# Altium project USB Charger Project.PrjPcb
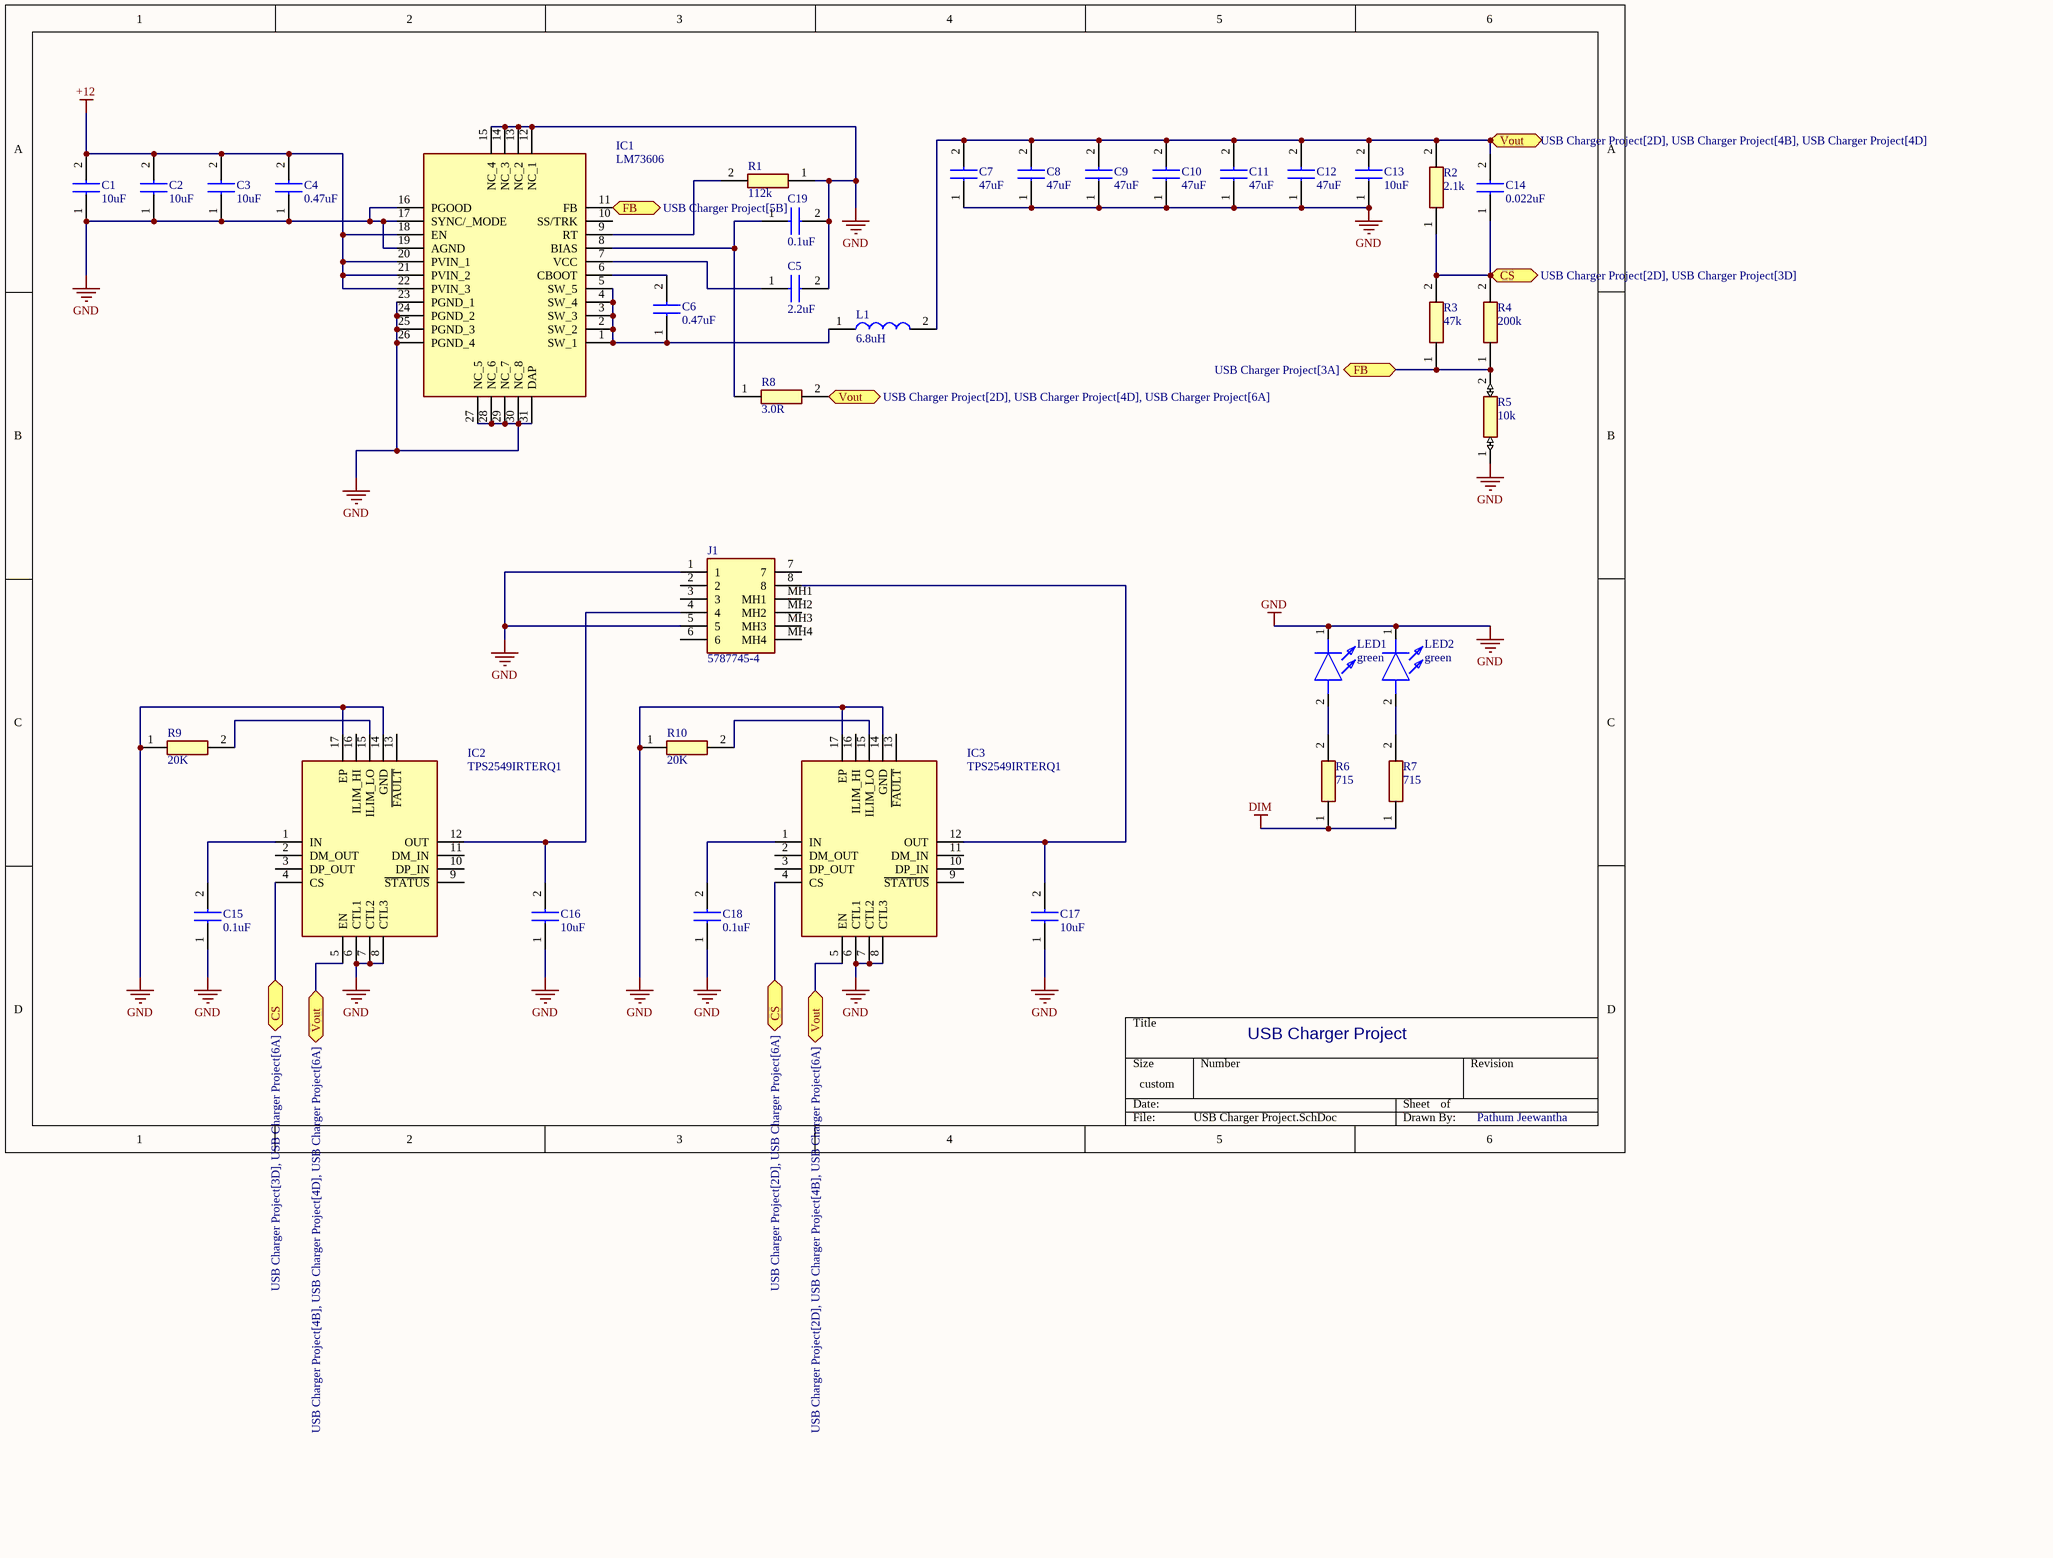
[diagram p0: USB Charger Project.SchDoc]
1 sheet, 36 parts. Net scope: flat (ports and power ports of the same name join across sheets).
Board file: USB Charger Project.PcbDoc

## Sheet USB Charger Project.SchDoc: USB Chager Schematic
size 304 x 215 mm; Author: P J Dissanayake; DrawnBy: P J Dissanayake; SheetNumber: 1; SheetTotal: 1

### Parts
C1  10uF  [CAPPM7343X120N]
C2  10uF  [CAPPM7343X120N]
C3  10uF  [CAPPM7343X120N]
C4  0.47uF  [CAPC6050X550N]
C5  2.2uF  [CAPC1608X80N]
C6  0.47uF  [CAPC6050X550N]
C7  47uF  [CAPC3225X270N]
C8  47uF  [CAPC3225X270N]
C9  47uF  [CAPC3225X270N]
C10  47uF  [CAPC3225X270N]
C11  47uF  [CAPC3225X270N]
C12  47uF  [CAPC3225X270N]
C13  10uF  [CAPPM7343X120N]
C14  0.022uF  [CAPC2012X88N]
C15  0.1uF  [C0805]
C16  10uF  [CAPPM7343X120N]
C17  10uF  [CAPPM7343X120N]
C18  0.1uF  [C0805]
C19  0.1uF  [C0805]
IC1  LM73606  [QFN50P400X600X80-31N-D]
IC2  TPS2549IRTERQ1  [QFN50P300X300X80-17N-D]
IC3  TPS2549IRTERQ1  [QFN50P300X300X80-17N-D]
J1  5787745-4  [57877454]
L1  6.8uH  [SDR08056R8ML]
LED1  green  [LEDM2012X80N]
LED2  green  [LEDM2012X80N]
R1  112k  [RESC0603X28N]
R2  2.1k  [RESC1005X35N]
R3  47k  [RESC2012X65N]
R4  200k  [RESC1608X55N]
R5  10k  [RESC6432X120N]
R6  715  [RESC1608X55N]
R7  715  [RESC1608X55N]
R8  3.0R  [ERJ2RKD1004X]
R9  20K  [RESC2013X65N]
R10  20K  [RESC2013X65N]

### Ports
CS (bidir, see USB Charger Project[2D], USB Charger Project[3D]), CS (bidir, see USB Charger Project[2D], USB Charger Project[6A]), CS (bidir, see USB Charger Project[3D], USB Charger Project[6A]), FB (bidir, see USB Charger Project[3A]), FB (bidir, see USB Charger Project[5B]), Vout (bidir, see USB Charger Project[2D], USB Charger Project[4B], USB Charger Project[4D]), Vout (bidir, see USB Charger Project[2D], USB Charger Project[4B], USB Charger Project[6A]), Vout (bidir, see USB Charger Project[2D], USB Charger Project[4D], USB Charger Project[6A]), Vout (bidir, see USB Charger Project[4B], USB Charger Project[4D], USB Charger Project[6A])

### Nets
+12: C1.2(-) C2.2(-) C3.2(-) C4.2 IC1.18(EN) IC1.20(PVIN_1) IC1.21(PVIN_2) IC1.22(PVIN_3)
DIM: R6.1 R7.1
GND: C1.1(+) C2.1(+) C3.1(+) C4.1 C5.2 C7.1 C8.1 C9.1 C10.1 C11.1 C12.1 C13.1(+) C15.1 C16.1(+) C17.1(+) C18.1 C19.2 IC1.12(NC_1) IC1.13(NC_2) IC1.14(NC_3) IC1.15(NC_4) IC1.16(PGOOD) IC1.17(SYNC/_MODE) IC1.19(AGND) IC1.23(PGND_1) IC1.24(PGND_2) IC1.25(PGND_3) IC1.26(PGND_4) IC1.27(NC_5) IC1.28(NC_6) IC1.29(NC_7) IC1.30(NC_8) IC1.31(DAP) IC2.6(CTL1) IC2.7(CTL2) IC2.8(CTL3) IC2.14(GND) IC2.17(EP) IC3.6(CTL1) IC3.7(CTL2) IC3.8(CTL3) IC3.14(GND) IC3.17(EP) J1.1 J1.5 LED1.1(K) LED2.1(K) R1.1 R5.1 R9.1 R10.1
NetC5_1: C5.1 IC1.7(VCC)
NetC6_1: C6.1 IC1.1(SW_1) IC1.2(SW_2) IC1.3(SW_3) IC1.4(SW_4) IC1.5(SW_5) L1.1
NetC6_2: C6.2 IC1.6(CBOOT)
NetC7_2: C7.2 C8.2 C9.2 C10.2 C11.2 C12.2 C13.2(-) C14.2 IC2.5(EN) IC3.5(EN) L1.2 R2.2 R8.2 ; port Vout
NetC14_1: C14.1 IC2.4(CS) IC3.4(CS) R2.1 R3.2 R4.2 ; port CS
NetC15_2: C15.2 IC2.1(IN)
NetC16_2: C16.2(-) IC2.12(OUT) J1.4
NetC17_2: C17.2(-) IC3.12(OUT) J1.8
NetC18_2: C18.2 IC3.1(IN)
NetC19_1: C19.1 IC1.8(BIAS) R8.1
NetIC1_9: IC1.9(RT) R1.2
NetIC1_11: IC1.11(FB) R3.1 R4.1 R5.2 ; port FB
NetIC2_15: IC2.15(ILIM_LO) R9.2
NetIC3_15: IC3.15(ILIM_LO) R10.2
NetLED1_2: LED1.2(A) R6.2
NetLED2_2: LED2.2(A) R7.2

Not connected (* = marked no-connect by the designer): IC1 10(SS/TRK); IC2 2(DM_OUT) 3(DP_OUT) 9(~{STATUS}) 10(DP_IN) 11(DM_IN) 13(~{FAULT}) 16(ILIM_HI); IC3 2(DM_OUT) 3(DP_OUT) 9(~{STATUS}) 10(DP_IN) 11(DM_IN) 13(~{FAULT}) 16(ILIM_HI); J1 2 3 6 7 MH1 MH2 MH3 MH4

### Notes on the sheet
- USB Charger Project
- Pathum Jeewantha

### Library data of the parts
C1-C3 C13 C16 C17 = EEF-CS1E100R: Capacitor; Manufacturer_Name: Panasonic; Datasheet Link: https://industrial.panasonic.com/cdbs/www-data/pdf/ABE0000/ABE0000C49.pdf; Height: 1.2mm; Manufacturer_Part_Number: EEF-CS1E100R; Mouser Part Number: 667-EEF-CS1E100R; Mouser Price/Stock: https://www.mouser.com/Search/Refine.aspx?Keyword=667-EEF-CS1E100R; Arrow Part Number: EEF-CS1E100R; Arrow Price/Stock: https://www.arrow.com/en/products/eef-cs1e100r/panasonic
C4 C6 = CKG57NX7R2J474M500JH: Capacitor; Manufacturer_Name: TDK; Datasheet Link: https://product.tdk.com/system/files/dam/doc/product/capacitor/ceramic/mlcc/catalog/mlcc_commercial_megacap_en.pdf; Height: 5.5mm; Manufacturer_Part_Number: CKG57NX7R2J474M500JH; Mouser Part Number: 810-CKG57NX7R2J474M; Mouser Price/Stock: https://www.mouser.co.uk/ProductDetail/TDK/CKG57NX7R2J474M500JH?qs=NRhsANhppD%252BAmXDR5rVERg%3D%3D; Arrow Part Number: CKG57NX7R2J474M500JH; Arrow Price/Stock: https://www.arrow.com/en/products/ckg57nx7r2j474m500jh/tdk?region=nac
C5 = C1608X7R0J225K080AB: Capacitor; Manufacturer_Name: TDK; Datasheet Link: https://product.tdk.com/info/en/catalog/datasheets/mlcc_commercial_midvoltage_en.pdf; Height: 0.8mm; Manufacturer_Part_Number: C1608X7R0J225K080AB; Mouser Part Number: 810-C1608X7R0J225K; Mouser Price/Stock: https://www.mouser.co.uk/ProductDetail/TDK/C1608X7R0J225K080AB?qs=NRhsANhppD8GGBuKEoCmvQ%3D%3D; Arrow Part Number: C1608X7R0J225K080AB; Arrow Price/Stock: https://www.arrow.com/en/products/c1608x7r0j225k080ab/tdk
C7-C12 = JMK325B7476KMHPR: Capacitor; Manufacturer_Name: TAIYO YUDEN; Datasheet Link: https://ds.yuden.co.jp/TYCOMPAS/ut/detail?pn=MCASJ32MSB7476KPNB25&u=M; Height: 2.7mm; Manufacturer_Part_Number: JMK325B7476KMHPR; Mouser Part Number: 963-JMK325B7476KMHPR; Mouser Price/Stock: https://www.mouser.com/Search/Refine.aspx?Keyword=963-JMK325B7476KMHPR
C14 = C0805C223K5RAC-TU: Capacitor; Manufacturer_Name: KEMET; Datasheet Link: https://connect.kemet.com:7667/gateway/IntelliData-ComponentDocumentation/1.0/download/specsheet/C0805C223K5RACTU; Height: 0.88mm; Manufacturer_Part_Number: C0805C223K5RAC-TU; Arrow Part Number: C0805C223K5RAC-TU; Arrow Price/Stock: https://www.arrow.com/en/products/c0805c223k5ractu/kemet-corporation
C15 C18 C19 = C0805X104K5RAC3316: Capacitor; Manufacturer_Name: KEMET; Datasheet Link: https://content.kemet.com/datasheets/KEM_X7R_FT_VW_AUDI.pdf; Height: 1.1mm; Manufacturer_Part_Number: C0805X104K5RAC3316; Mouser Part Number: 80-C0805X104K5R3316; Mouser Price/Stock: https://www.mouser.co.uk/ProductDetail/KEMET/C0805X104K5RAC3316?qs=vLWxofP3U2wSOEpkvhvxCw%3D%3D; Arrow Part Number: C0805X104K5RAC3316; Arrow Price/Stock: https://www.arrow.com/en/products/c0805x104k5rac3316/kemet-corporation?region=nac
IC1 = LM73605RNPR: Integrated Circuit; Manufacturer_Name: Texas Instruments; Datasheet Link: https://www.ti.com/lit/ds/symlink/lm73605.pdf?HQS=dis-dk-null-digikeymode-dsf-pf-null-wwe&ts=1649048227749&ref_url=https%253A%252F%252Fwww.ti.com%252Fgeneral%252Fdocs%252Fsuppproductinfo.tsp%253FdistId%253D10%2526gotoUrl%253Dhttps%253A%252F%252Fwww.ti.com; Height: 0.8mm; Manufacturer_Part_Number: LM73605RNPR; Mouser Part Number: 595-LM73605RNPR; Mouser Price/Stock: https://www.mouser.co.uk/ProductDetail/Texas-Instruments/LM73605RNPR?qs=G55MHhPmvtKjvNMBdwXrjw%3D%3D
IC2 IC3 = TPS2549IRTERQ1: Integrated Circuit; Manufacturer_Name: Texas Instruments; Datasheet Link: http://www.ti.com/lit/gpn/TPS2549-Q1; Height: 0.8mm; Manufacturer_Part_Number: TPS2549IRTERQ1; Mouser Part Number: 595-TPS2549IRTERQ1; Mouser Price/Stock: https://www.mouser.co.uk/ProductDetail/Texas-Instruments/TPS2549IRTERQ1?qs=bY1dm4K8r4UUPMmrjPHWqg%3D%3D; Arrow Part Number: TPS2549IRTERQ1; Arrow Price/Stock: https://www.arrow.com/en/products/tps2549irterq1/texas-instruments
J1 = 5787745-4: Connector; Manufacturer_Name: TE Connectivity; Datasheet Link: https://www.te.com/commerce/DocumentDelivery/DDEController?Action=showdoc&DocId=Customer+Drawing%7F5787745%7FA2%7Fpdf%7FEnglish%7FENG_CD_5787745_A2.pdf%7F5787745-4; Height: 16.26mm; Manufacturer_Part_Number: 5787745-4; Mouser Part Number: 571-5787745-4; Mouser Price/Stock: https://www.mouser.co.uk/ProductDetail/TE-Connectivity-AMP/5787745-4?qs=ozkTL%2FUej0Qyafe7%252BOKSRQ%3D%3D; Arrow Part Number: 5787745-4; Arrow Price/Stock: https://www.arrow.com/en/products/5787745-4/te-connectivity
L1 = SDR0805-6R8ML: Inductor; Manufacturer_Name: Bourns; Datasheet Link: https://componentsearchengine.com/Datasheets/2/SDR0805-6R8ML.pdf; Height: 5.3mm; Manufacturer_Part_Number: SDR0805-6R8ML; Mouser Part Number: 652-SDR0805-6R8ML; Mouser Price/Stock: https://www.mouser.co.uk/ProductDetail/Bourns/SDR0805-6R8ML?qs=uD%2FoUDWqfvRMWomOplYMJg%3D%3D
LED1 LED2 = 150080GS75000: LED; Manufacturer_Name: Wurth Elektronik; Datasheet Link: https://katalog.we-online.com/led/datasheet/150080GS75000.pdf; Height: 0.8mm; Manufacturer_Part_Number: 150080GS75000; Mouser Part Number: 710-150080GS75000; Mouser Price/Stock: https://www.mouser.co.uk/ProductDetail/Wurth-Elektronik/150080GS75000?qs=2kOmHSv6VfQRoTEZVk1mGA%3D%3D
R1 = CRCW020112K1FNED: Resistor; Manufacturer_Name: Vishay; Datasheet Link: http://www.vishay.com/docs/20035/dcrcwe3.pdf; Height: 0.28mm; Manufacturer_Part_Number: CRCW020112K1FNED
R2 = CPF0402B2K1E1: Resistor; Manufacturer_Name: TE Connectivity; Datasheet Link: http://www.farnell.com/datasheets/1786775.pdf; Height: 0.35mm; Manufacturer_Part_Number: CPF0402B2K1E1
R3 = CRG0805F47K: Resistor; Manufacturer_Name: TE Connectivity; Datasheet Link: http://www.te.com/commerce/DocumentDelivery/DDEController?Action=showdoc&DocId=Customer+Drawing%7F1623109%7FBA%7Fpdf%7FEnglish%7FENG_CD_1623109_BA.pdf%7F1623109-1; Height: 0.65mm; Manufacturer_Part_Number: CRG0805F47K; Mouser Part Number: 279-CRG0805F47K; Mouser Price/Stock: https://www.mouser.co.uk/ProductDetail/TE-Connectivity-Holsworthy/CRG0805F47K?qs=VHcS2MTj4gZHzoMPVVm%252BWg%3D%3D; Arrow Part Number: CRG0805F47K; Arrow Price/Stock: https://www.arrow.com/en/products/crg0805f47k/te-connectivity?region=nac
R4 = CRGH0603F20K: Resistor; Manufacturer_Name: TE Connectivity; Datasheet Link: http://docs-europe.electrocomponents.com/webdocs/12d7/0900766b812d7379.pdf; Height: 0.55mm; Manufacturer_Part_Number: CRGH0603F20K; Mouser Part Number: 279-CRGH0603F20K; Mouser Price/Stock: https://www.mouser.co.uk/ProductDetail/TE-Connectivity-Holsworthy/CRGH0603F20K?qs=iJVBkmKXgrmcei%252BB1D3Tlg%3D%3D
R5 = 352110KFT: Resistor; Manufacturer_Name: TE Connectivity; Datasheet Link: https://eagle.componentsearchengine.com/Datasheets/2/352110KFT.pdf; Height: 1.2mm; Manufacturer_Part_Number: 352110KFT; Mouser Part Number: 279-352110KFT; Mouser Price/Stock: https://www.mouser.co.uk/ProductDetail/TE-Connectivity-Holsworthy/352110KFT?qs=IXkKOuu5vnE9cBrG90Zs%2Fw%3D%3D; Arrow Part Number: 352110KFT; Arrow Price/Stock: https://www.arrow.com/en/products/352110kft/te-connectivity
R6 R7 = CPF0603B715RE1: Resistor; Manufacturer_Name: TE Connectivity; Datasheet Link: http://www.farnell.com/datasheets/1786775.pdf; Height: 0.55mm; Manufacturer_Part_Number: CPF0603B715RE1
R8 = ERJ-2GEJ3R0X: Resistor; Manufacturer_Name: Panasonic; Datasheet Link: https://datasheet.datasheetarchive.com/originals/distributors/DKDS40/DSANUWW0010665.pdf; Height: 0.4mm; Manufacturer_Part_Number: ERJ-2GEJ3R0X; Mouser Part Number: 667-ERJ-2GEJ3R0X; Mouser Price/Stock: https://www.mouser.com/Search/Refine.aspx?Keyword=667-ERJ-2GEJ3R0X; Arrow Part Number: ERJ-2GEJ3R0X; Arrow Price/Stock: https://www.arrow.com/en/products/erj-2gej3r0x/panasonic
R9 R10 = TNPW080520K0BEEN: Resistor; Manufacturer_Name: Vishay; Datasheet Link: http://componentsearchengine.com/Datasheets/1/TNPW080520K0BEEN.pdf; Manufacturer_Part_Number: TNPW080520K0BEEN; Mouser Part Number: 71-TNPW080520K0BEEN; Mouser Price/Stock: https://www.mouser.co.uk/ProductDetail/Vishay-Dale/TNPW080520K0BEEN?qs=Db%252BqmG6P6GbXMUPhkKoL5w%3D%3D; Arrow Part Number: TNPW080520K0BEEN; Arrow Price/Stock: https://www.arrow.com/en/products/tnpw080520k0been/vishay?region=nac